# EAGLE design 3.5mm (EAGLE 6.5.0)
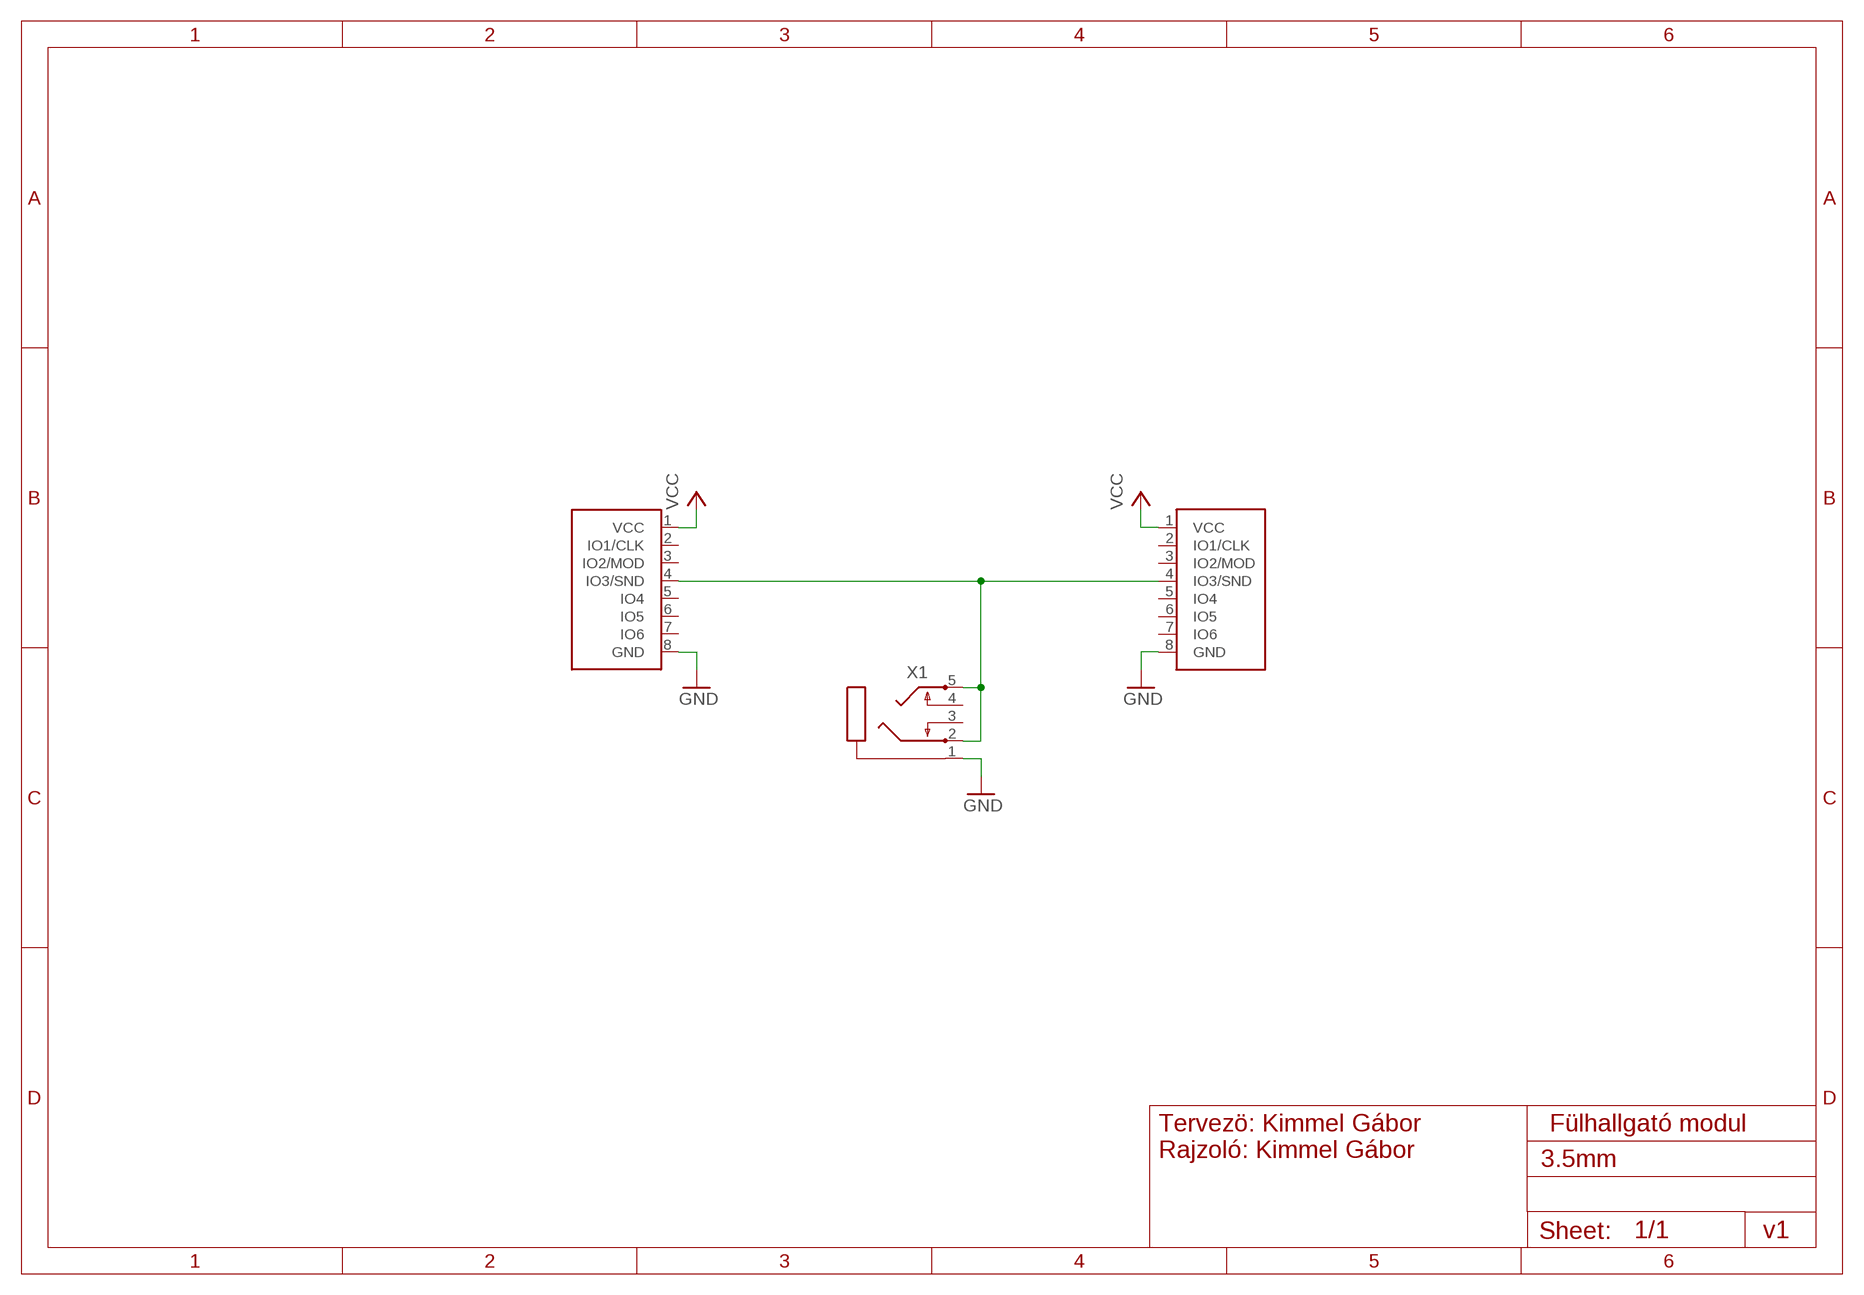
[diagram p0: schematic, sheet 1]

## Parts
U$1  GANZ-CONNECTOR  [FE08W]
U$2  GANZ-CONNECTOR-OUT  [MA08-1W]
X1  PG203J  [PG203J]

## Nets
GND: U$1.8(GND) U$2.8(GND) X1.1
N$1: U$1.4(IO3/SND) U$2.4(IO3/SND) X1.2 X1.5
VCC: U$1.1(VCC) U$2.1(VCC)
Unconnected: U$1.2(IO1/CLK) U$1.3(IO2/MOD) U$1.5(IO4) U$1.6(IO5) U$1.7(IO6) U$2.2(IO1/CLK) U$2.3(IO2/MOD) U$2.5(IO4) U$2.6(IO5) U$2.7(IO6) X1.3 X1.4

## Notes on the sheet
- Tervezö: Kimmel Gábor
  Rajzoló: Kimmel Gábor
- Fülhallgató modul
- v1

## Library data of the parts
U$1 = ganzlib:GANZ-CONNECTOR
U$2 = ganzlib:GANZ-CONNECTOR-OUT
X1 = con-hirschmann:PG203J: MIC/HEADPHONE JACK KS-S stereo microphone/headphone jack PG203JN (Schukat); OC_FARNELL: unknown; OC_NEWARK: unknown

## Board
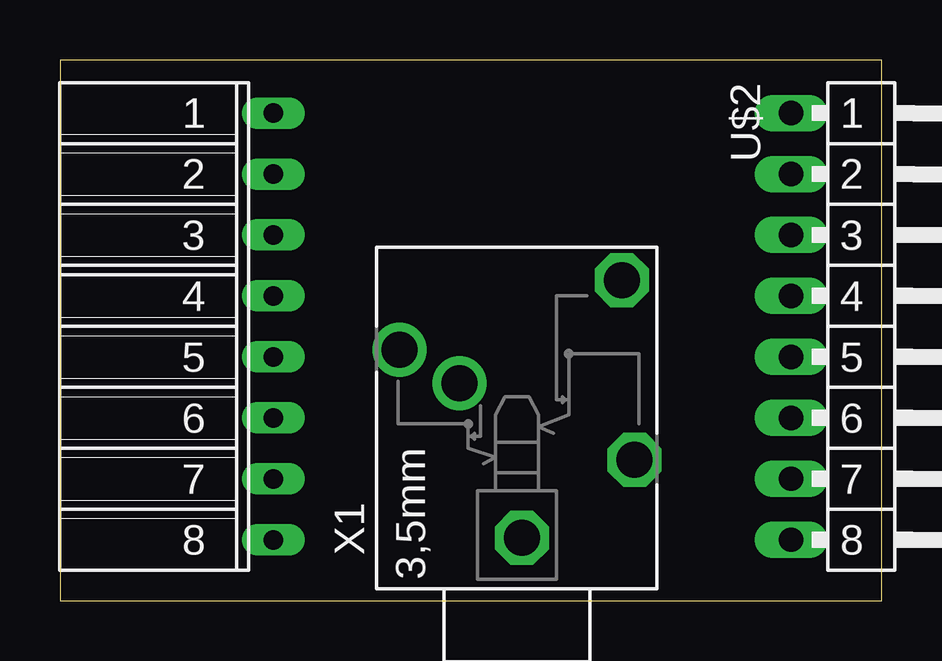
[diagram p1: board, top side]
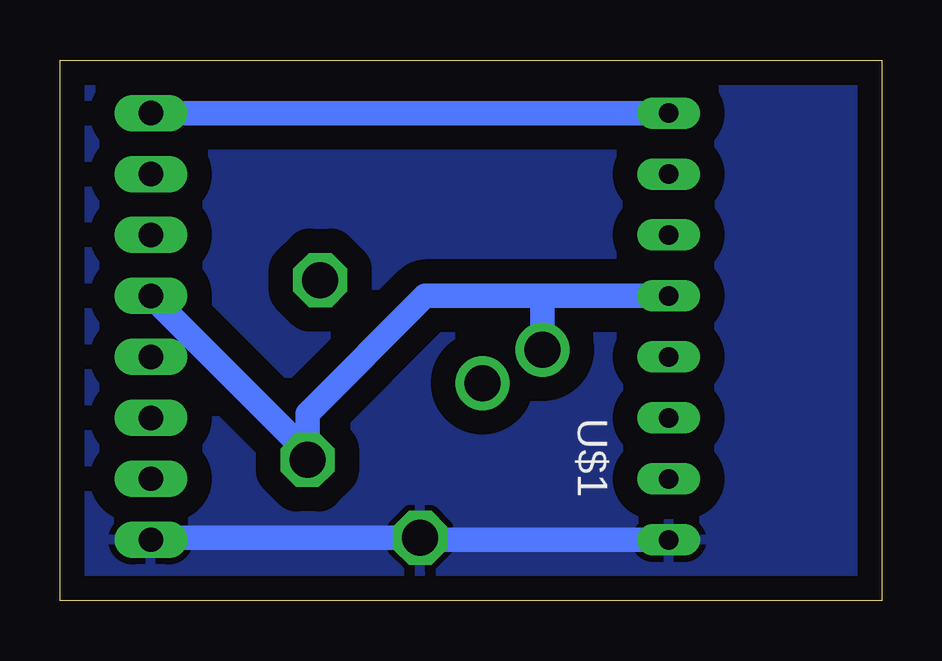
[diagram p2: board, bottom side, seen from below]

Size 34.27 x 22.53 mm. Coordinates in mm from the lower left corner, seen from the top.
Outline: 0,0 34.27,0 34.27,22.53 0,22.53 0,0
Copper layers (1*16): Top 0.035mm / dielectric 1.5mm / Bottom 0.035mm
Design rules "default *": minimum track width 10mil, minimum drill 24mil, track to track 8mil, track to pad 8mil, pad to pad 8mil, via to via 8mil, smd to smd 8mil, copper to edge 40mil, drill to drill 8mil, minimum pad ring 10mil, minimum via ring 8mil, stop-mask expansion 4mil, vias tented up to drill 0mil, thermal gap 10mil

### Footprints (pad centres in the part's own frame; a part is rotated, then mirrored left to right if it is on the bottom)
FE08W = drill 0.813 long: 1 5.08,8.89; 2 5.08,6.35; 3 5.08,3.81; 4 5.08,1.27; 5 5.08,-1.27; 6 5.08,-3.81; 7 5.08,-6.35; 8 5.08,-8.89
MA08-1W = drill 1.016 long: 1 0,8.89; 2 0,6.35; 3 0,3.81; 4 0,1.27; 5 0,-1.27; 6 0,-3.81; 7 0,-6.35; 8 0,-8.89
PG203J = drill 1.499 octagon: 1 -5.004,-0.203; 4 5.74,-4.369; 5 -1.753,-4.902 | drill 1.499: 2 2.845,4.902; 3 1.448,2.388

### Placement (x,y rotation side)
U$1  3.81,11.43 0 top
U$2  30.48,11.43 0 top
X1  19.05,7.62 90 top

### Tracks (layer width: path | path; a pad name or v marks a point on that pad's centre or on a via)
GND
  Bottom 1.016: U$1.8 19.25,2.54 X1.1 30.48,2.62 U$2.8
  pour Bottom (isolate 1.016): 0,22.86 34.29,22.86 34.29,0 0,0
N$1
  Bottom 1.016: U$1.4 13.97,12.7 | 13.97,12.7 19.05,12.7 23.95,7.8 X1.5 23.65,5.87 U$2.4 | X1.2 14.15,12.52 13.97,12.7
VCC
  Bottom 1.016: U$1.1 U$2.1